# Altium schematic sheet 10-USB-Prog.SchDoc
size B; SheetNumber: 10; SheetTotal: 19
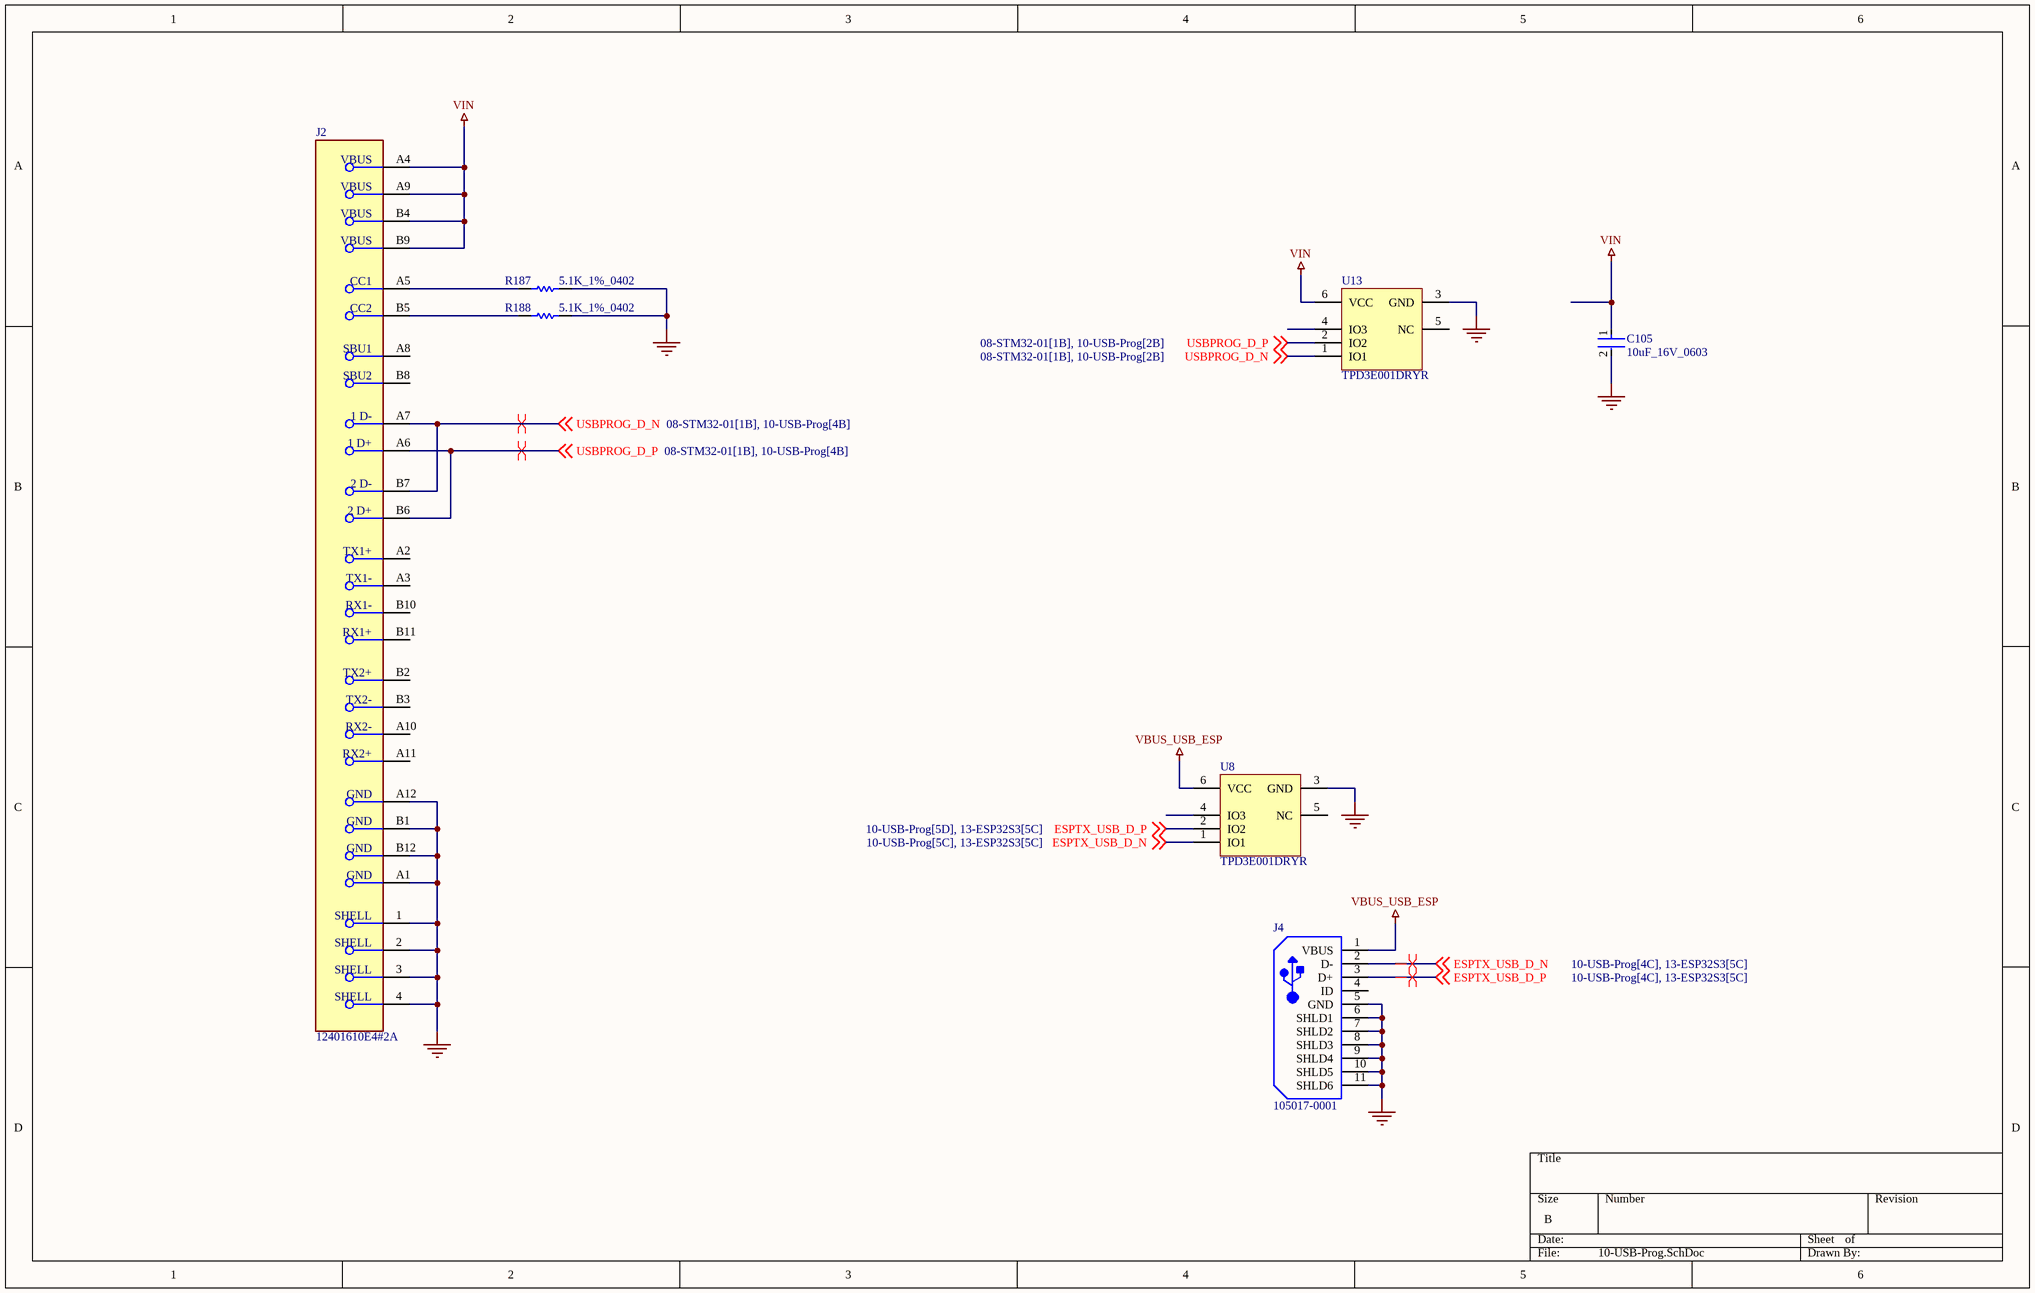
[diagram p0: 10-USB-Prog.SchDoc]

## Parts
C105  10uF_16V_0603  [FP-0603-L_1_6_0_2-W_0_8_0-MFG]
J2  12401610E4#2A  [FP-12401610E4#2A-MFG]
J4  105017-0001  [USB-MICRO-B_V]
R187  5.1K_1%_0402  [RESC1005X40X25NL05T10]
R188  5.1K_1%_0402  [RESC1005X40X25NL05T10]
U8  TPD3E001DRYR  [DRY0006A]
U13  TPD3E001DRYR  [DRY0006A]

## Nets
GND: C105.2 J2.1(SHELL) J2.2(SHELL) J2.3(SHELL) J2.4(SHELL) J2.A1(GND) J2.A12(GND) J2.B1(GND) J2.B12(GND) J4.5(GND) J4.6(SHLD1) J4.7(SHLD2) J4.8(SHLD3) J4.9(SHLD4) J4.10(SHLD5) J4.11(SHLD6) R187.2 R188.2 U8.3(GND) U13.3(GND)
VBUS_USB_ESP: J4.1(VBUS) U8.6(VCC)
VIN: C105.1 J2.A4(VBUS) J2.A9(VBUS) J2.B4(VBUS) J2.B9(VBUS) U13.6(VCC)
ESPTX_USB_D_N: J4.2(D-) U8.1(IO1) ; off-sheet ESPTX_USB_D_N
ESPTX_USB_D_P: J4.3(D+) U8.2(IO2) ; off-sheet ESPTX_USB_D_P
USBPROG_D_N: J2.A7(1_D-) J2.B7(2_D-) U13.1(IO1) ; off-sheet USBPROG_D_N
USBPROG_D_P: J2.A6(1_D+) J2.B6(2_D+) U13.2(IO2) ; off-sheet USBPROG_D_P
NetJ2_A5: J2.A5(CC1) R187.1
NetJ2_B5: J2.B5(CC2) R188.1

Not connected (* = marked no-connect by the designer): J2 A2(TX1+) A3(TX1-) A8(SBU1) A10(RX2-) A11(RX2+) B2(TX2+) B3(TX2-) B8(SBU2) B10(RX1-) B11(RX1+); J4 4(ID); U8 4(IO3) 5(NC); U13 4(IO3) 5(NC)

## Layout directives
differential pair: ESPTX_USB_D_N, ESPTX_USB_D_P, USBPROG_D_N, USBPROG_D_P

## Library data of the parts
C105 = CMP-2000-06226-4: Multilayer Ceramic Capacitor 10uF 16V X5R 20% SMD 0603 T/R; Packaging: Tape and Reel; Construction: Flat; Height: 0.8mm; Max Operating Temperature: 85°C; Dielectric: X5R; Case Code (Metric): 1608; Voltage Rating (DC): 16V; Width: 0.031inch; Voltage Rating: 16V; Length: 0.063inch; RoHS Compliant: Yes; Halogen Free: Halogen Free; Case Code (Imperial): 0603; Capacitance: 10uF; Mount: Surface Mount; Thickness: 0.031inch; Tolerance: 20%; Min Operating Temperature: -55°C; Series: M; Termination: SMD/SMT; Case/Package: 0603; Package Quantity: 1
J2 = CMP-02355-000003-1: CONN RCP USB3.1 TYPEC 24P SMD RA; Connector Type: USB; Number of Contacts: 24; Gender: Receptacle; Packaging: Cut Tape; Mount: Surface Mount; Number of Pins: 24
J4 = CMP-2000-05827-1: Micro-USB B Receptacle, Right Angle, Bottom Mount, Surface Mount, with Solder Tabs, -30 to 85 degC, 5-Pin USB, RoHS, Tape and Reel; Manufacturer: Molex; Featured Product: Micro-USBConnectorsUSBConnectors; Other Names: WM1399DKR; Package Version: Rev. F, 12/2012; Number of Contacts: 5; Connector Type: USB-microB; Catalog Drawings: 1050170001; 3D Model: 105017-0001.stp; Mating Products: WM17145-ND-CABLEMICROUSBBTOSTDA1.0MWM17147-ND-CABLEMICROUSBBTOSTDA2.0MWM17146-ND-CABLEMICROUSBBTOSTDA1.5M; PCN Assembly/Origin: ResinSupplier21/Oct/2015; Voltage - Max: 30V; Online Catalog: Molex-MicroUSB; Manufacturer URL: http://www.molex.com/; Package Description: 5-Leads USB, Micro B, Body 7.5 x 5 mm, Pitch 0.65 mm; Datasheet URL: http://www.molex.com/elqNow/elqRedir.htm?ref=http://www.molex.com/webdocs/datasheets/pdf/en-us/1050170001_IO_CONNECTORS.pdf; Ingress Protection: -; Datasheet Version: 03/2016; Mounting Type: BoardCutout,SurfaceMount,RightAngle; Circuits: 5; Standard Package: 1; Package Reference: MICRO-B; Package URL: http://www.molex.com/pdm_docs/sd/1050170001_sd.pdf; Category: Connectors,Interconnects; Series: -; RoHS Information: 1050170001CertofCompliance; Features: Shielded,SolderRetention; Family: USB,DVI,HDMIConnectors; Specifications: -; Gender: Receptacle; Packaging: Digi-Reel®; Mounting Technology: SurfaceMount
R187 R188 = CMP-2002-07753-1: Part Number: RC0402FR-075K1L; Manufacturer: Yageo / Phycomp
U8 U13 = CMP-0326-00032-3: Low-Capacitance + / - 15 kV ESD-Protection Array for High-Speed Data Interfaces, 3 Channels, -40 to +85 degC, 6-pin SON (DRY), Green (RoHS & no Sb/Br); Manufacturer: Texas Instruments; USB High Speed: TRUE; SubFamily: ESD Solution; IO Capacitance(Typ)(pF): 1.5; IEC 61000-4-2 Contact(+/- kV): 8; IO Leakage Current(nA): Jan-00; Breakdown Voltage(Min)(V): 11; IEC 61000-4-2 Air-Gap(+/- kV): 15; DatasheetVersion: SLLS683D; Mounting Technology: Surface Mount; ComponentLink1URL: http://www.ti.com/; PackageReference: DRY0006A; ComponentLink2URL: http://www.ti.com/general/docs/lit/getliterature.tsp?genericPartNumber=TPD3E001&fileType=pdf; ComponentLink2Description: Datasheet; ComponentLink3Description: URL Link1; PackageDescription: 6-Pin Plastic Small Outline No-Lead, 1 x 1.45 x 0.6 mm Body, 0.5 mm Pitch; ComponentLink1Description: Manufacturer URL; PackageVersion: revF, Dec-2011; PartNumber: TPD3E001DRYR; Eco-Plan: Green (RoHS & no Sb/Br); ComponentLink3URL: SamplesURL:http://www.ti.com/product/tpd3e001#samples